# Altium schematic sheet 12_Key.SchDoc
size A4
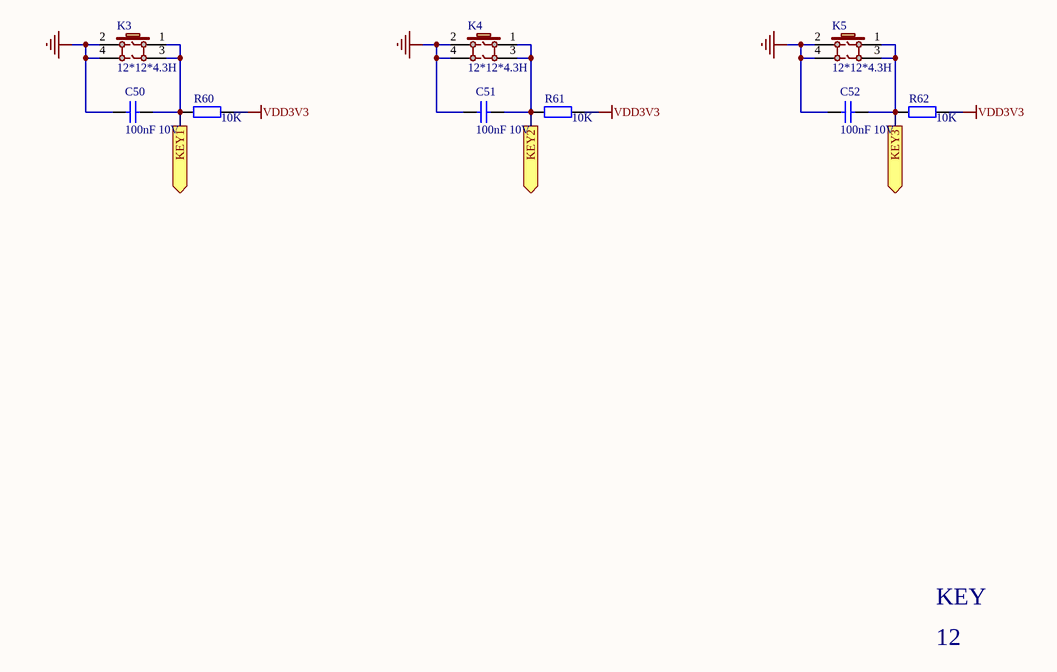
[diagram p0: 12_Key.SchDoc]

## Parts
C50  100nF 10V  [SMD-0603C]
C51  100nF 10V  [SMD-0603C]
C52  100nF 10V  [SMD-0603C]
K3  12*12*4.3H  [KEY-SMD12*12*4.3]
K4  12*12*4.3H  [KEY-SMD12*12*4.3]
K5  12*12*4.3H  [KEY-SMD12*12*4.3]
R60  10K  [SMD-0603]
R61  10K  [SMD-0603]
R62  10K  [SMD-0603]

## Ports
KEY1 (out), KEY2 (out), KEY3 (out)

## Nets
GND: C50.2 C51.2 C52.2 K3.2 K3.4 K4.2 K4.4 K5.2 K5.4
VDD3V3: R60.2 R61.2 R62.2
KEY1: C50.1 K3.1 K3.3 R60.1 ; port KEY1
KEY2: C51.1 K4.1 K4.3 R61.1 ; port KEY2
KEY3: C52.1 K5.1 K5.3 R62.1 ; port KEY3

## Notes on the sheet
- KEY
- 12

## Library data of the parts
C50-C52 = CAP4: 贴片电容 20%
K3-K5 = KEY2
R60-R62 = RES0: 贴片电阻 5%